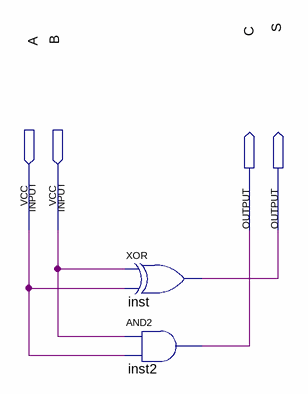
[diagram p0: schematic sheet]
// Quartus schematic half_adder.bdf as structural Verilog: 2 symbols, 4 pins
module half_adder (
  input  A,
  input  B,
  output C,
  output S
);

  xor inst (S, B, A);
  and inst2 (C, B, A);
endmodule
